# EAGLE board ActuatorBoard (EAGLE 9.6.2)
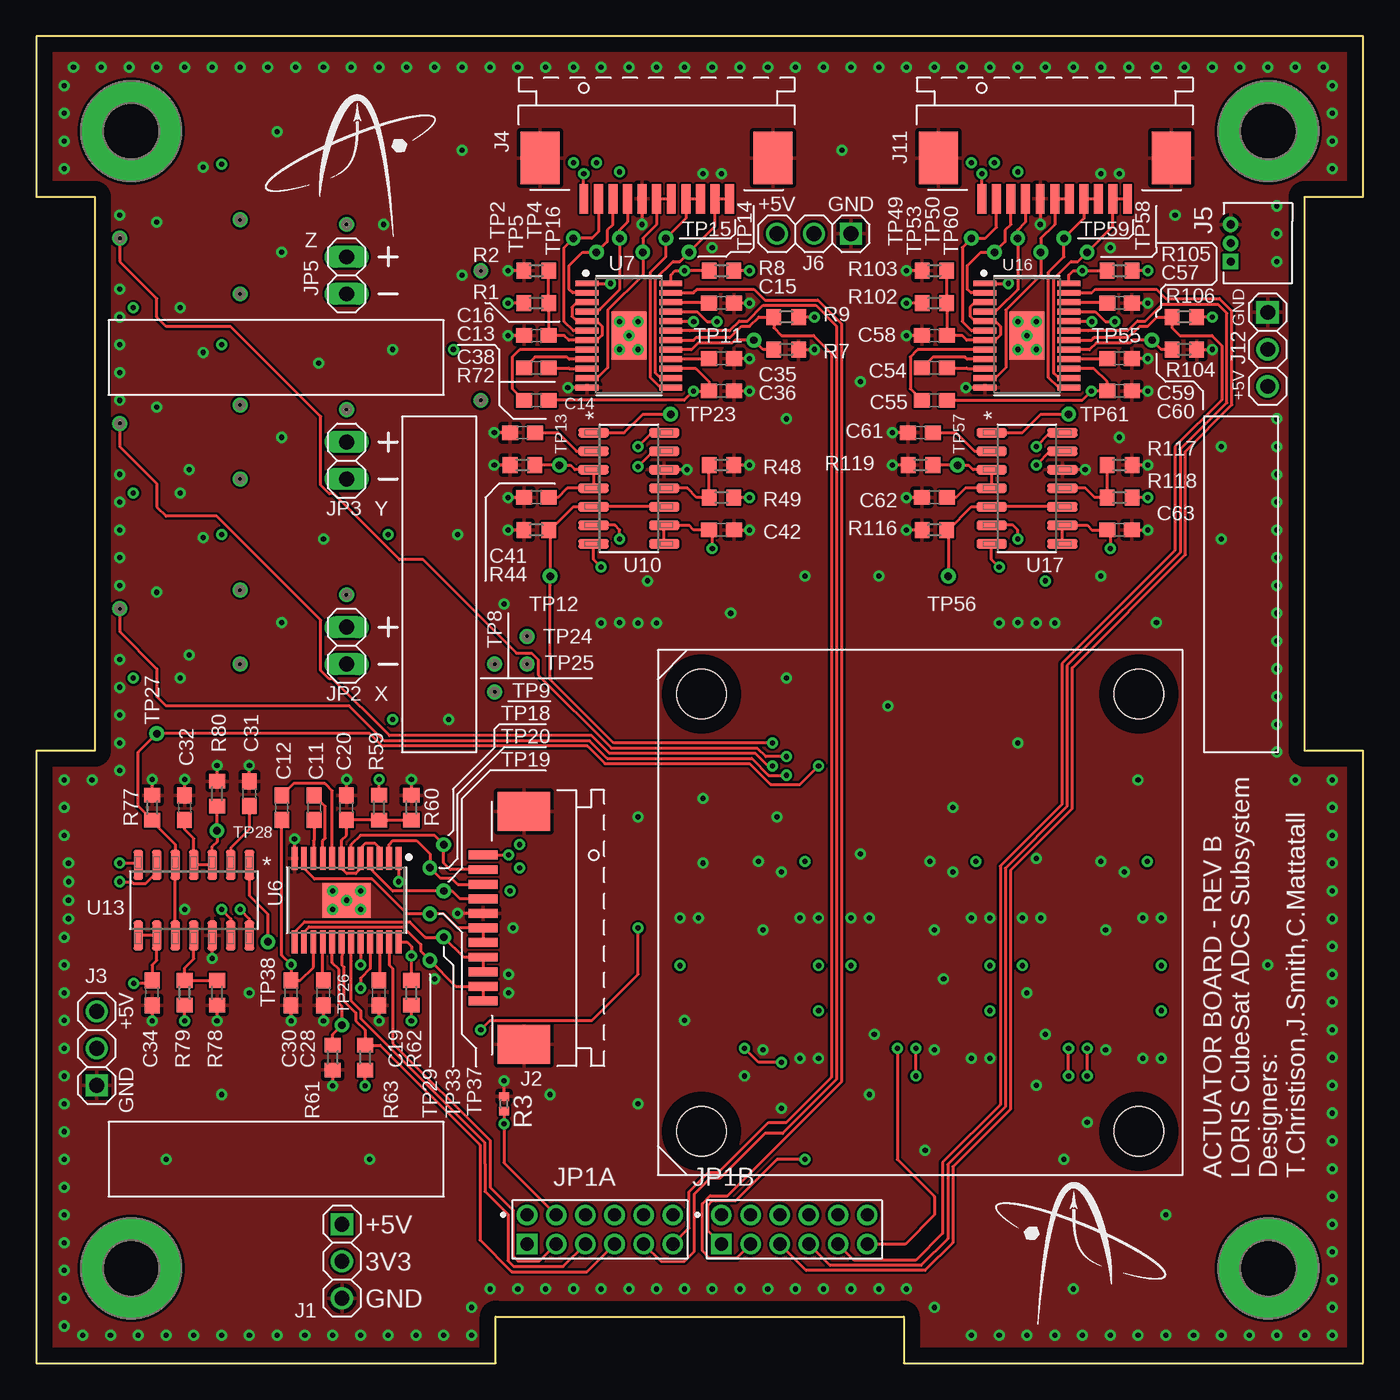
[diagram p6: board, top side]
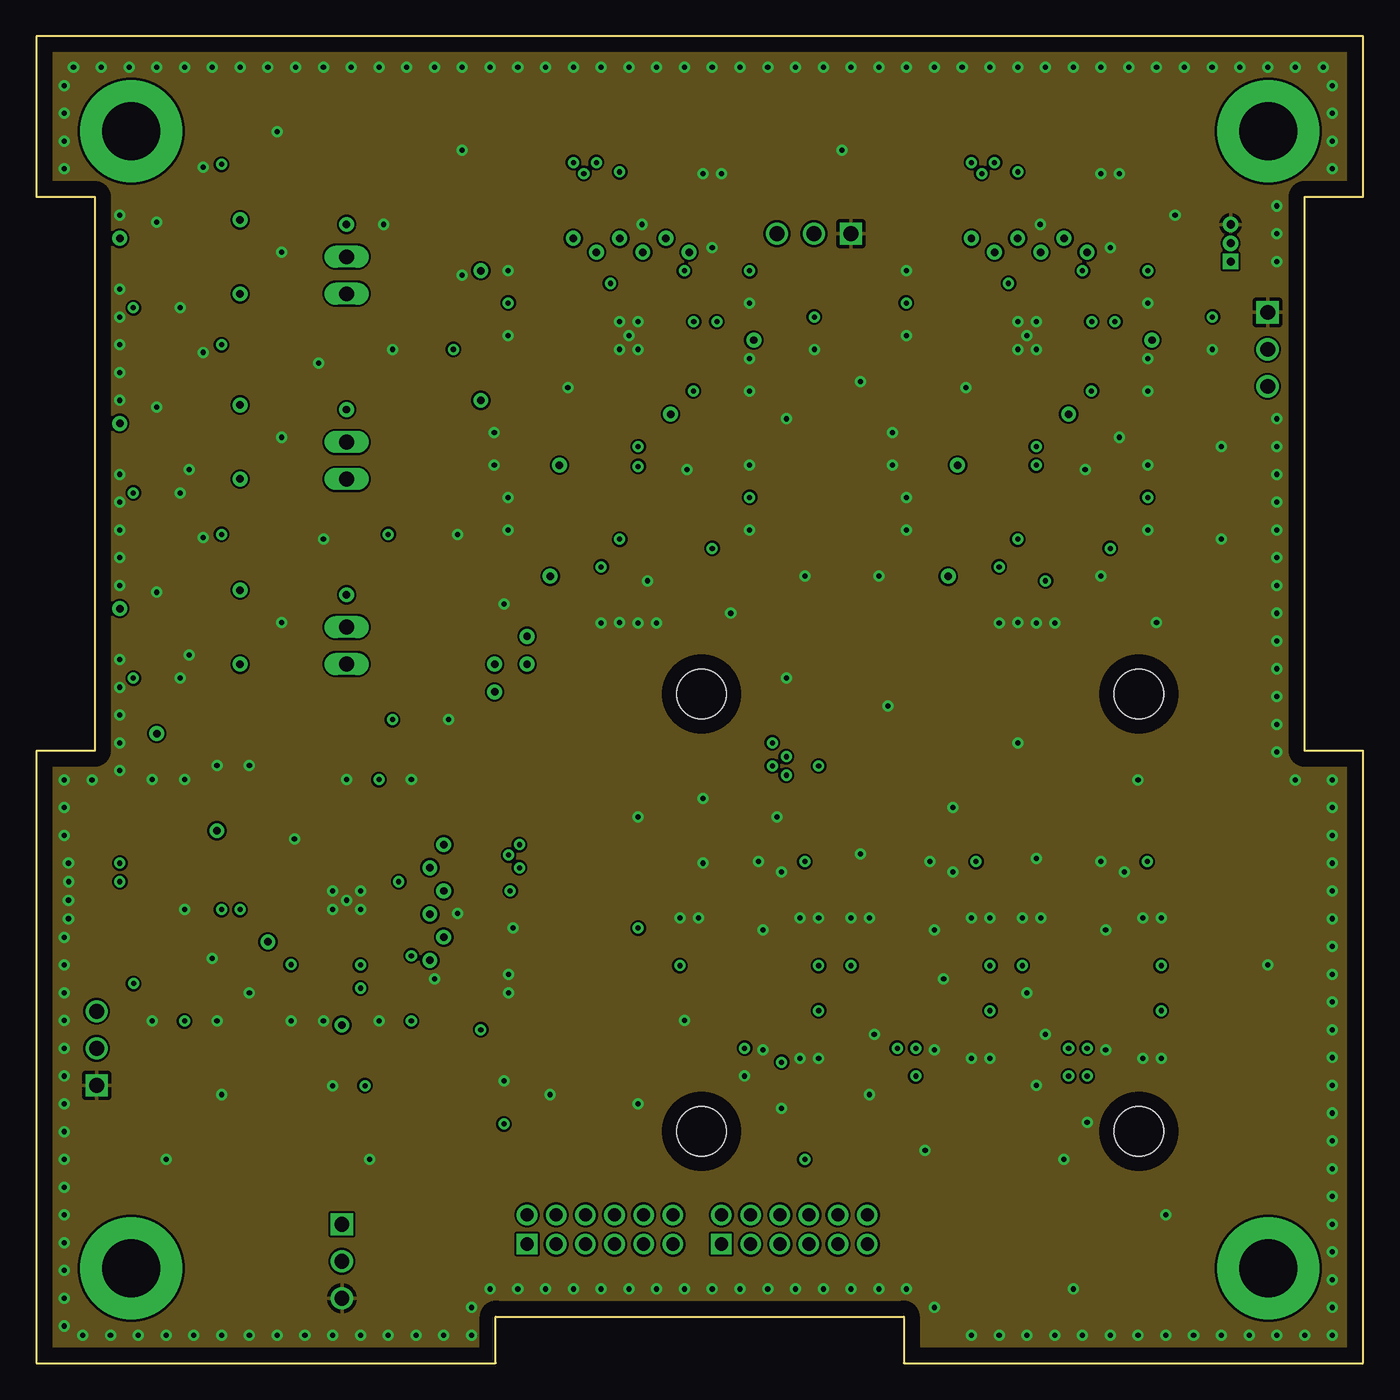
[diagram p7: board, inner layer GND]
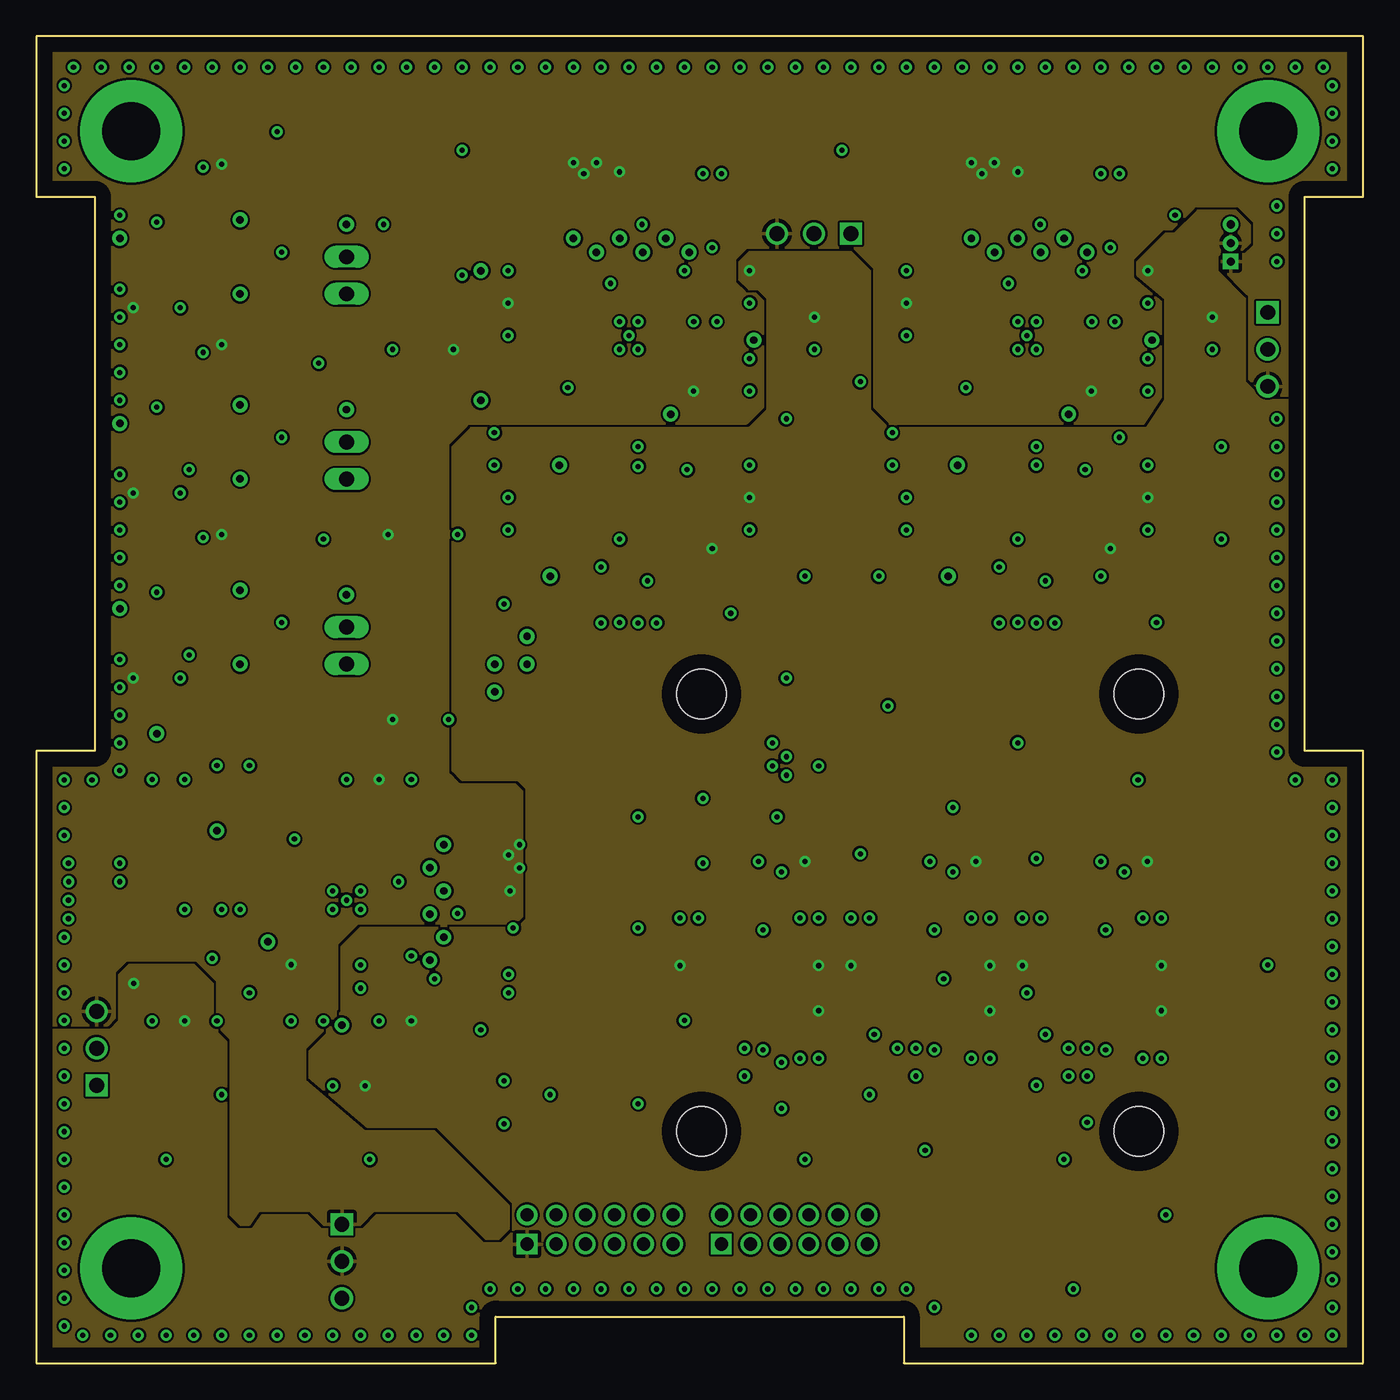
[diagram p8: board, inner layer POWER]
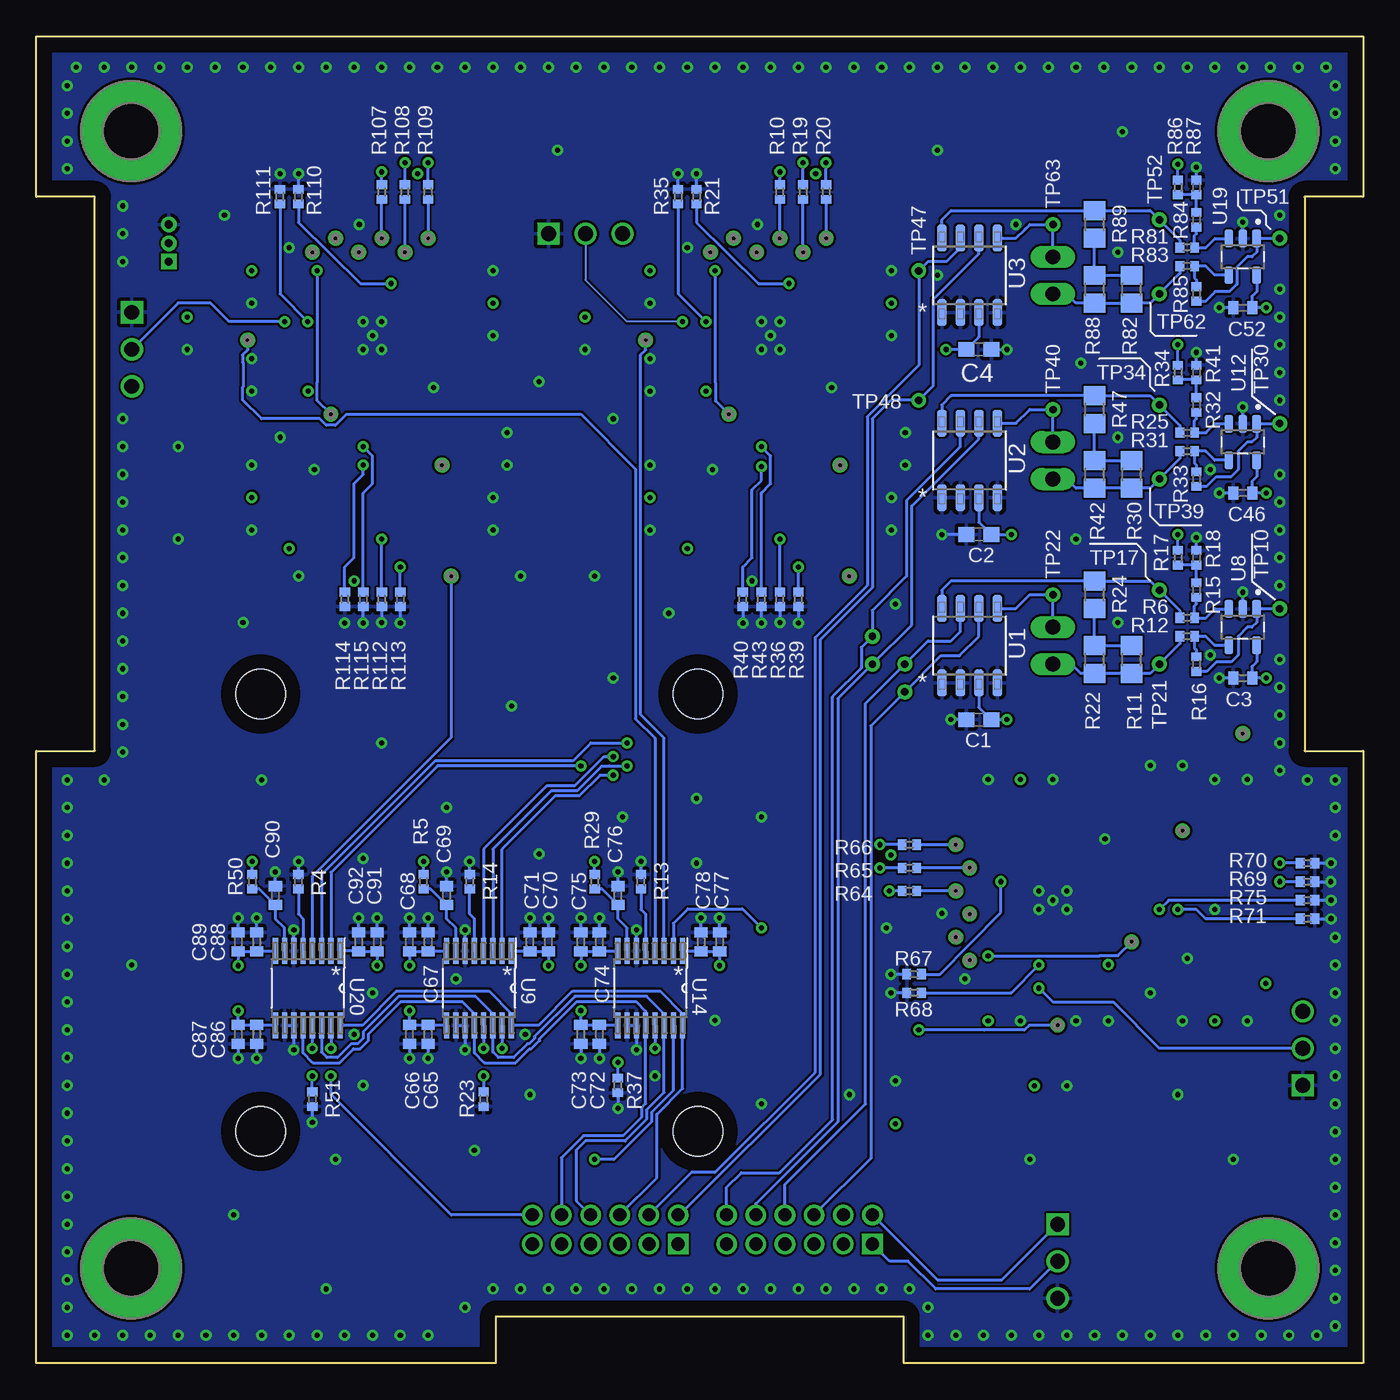
[diagram p9: board, bottom side, seen from below]

Size 91 x 91 mm. Coordinates in mm from the lower left corner, seen from the top.
Outline: 0,42 0,0 31.5,0 31.5,3.19 59.5,3.19 59.5,0 91,0 91,42 87,42 87,80 91,80 91,91 0,91 0,80 4,80 4,42 0,42
Copper layers (1+2*15+16): Top 0.035mm / dielectric 1.5mm / GND 0.035mm / dielectric 0.15mm / POWER 0.035mm / dielectric 0.2mm / Bottom 0.035mm
Design rules "default *": minimum track width 4mil, minimum drill 8mil, track to track 6mil, track to pad 6mil, pad to pad 6mil, via to via 6mil, smd to smd 6mil, copper to edge 40mil, drill to drill 6mil, minimum pad ring 10mil, minimum via ring 8mil, stop-mask expansion 0mil, vias tented up to drill 0mil, thermal gap 10mil

## Footprints (pad centres in the part's own frame; a part is rotated, then mirrored left to right if it is on the bottom)
C0603 = smd 1.1 x 1: 1 -0.85,0; 2 0.85,0
C0402 = smd 0.7 x 0.9: 1 -0.65,0; 2 0.65,0
1X03 = drill 1.016 square: 1 -2.54,0 | drill 1.016: 2 0,0; 3 2.54,0
TE_1-84953-1 = smd 0.61 x 2: 1 5,4.6; 2 4,4.6; 3 3,4.6; 4 2,4.6; 5 1,4.6; 6 0,4.6; 7 -1,4.6; 8 -2,4.6; 9 -3,4.6; 10 -4,4.6; 11 -5,4.6 | smd 2.68 x 3.6: TAB1 7.99,1.8; TAB2 -7.99,1.8
TE-1734829-3 = drill 0.55 square: 1 0,0 | drill 0.55: 2 -1.25,0; 3 -2.54,0
832-10-012-10-005000 = drill 0.9 pad 1.25 square: 1 0,-2 | drill 0.9 pad 1.25: 2 0,0; 3 2,-2; 4 2,0; 5 4,-2; 6 4,0; 7 6,-2; 8 6,0; 9 8,-2; 10 8,0; 11 10,-2; 12 10,0
1X02 = drill 1.016 long: 1 -1.27,0; 2 1.27,0
MTGP700H400 = drill 4 pad 7: 1 0,0
R0603 = smd 1 x 1.1: 1 -0.85,0; 2 0.85,0
R0402 = smd 0.6 x 0.7: 1 -0.5,0; 2 0.5,0
R0805 = smd 1.3 x 1.5: 1 -0.95,0; 2 0.95,0
RWA_NOPINS = hole 3.4: 3,3; 33,33; 33,3; 3,33
TP_P76H50 = drill 0.51 pad 0.762: 1 0,0
SOIC8P127_490X600X175L71X43N_SIP2100DY-T1-GE3 = smd 0.67 x 1.81: 1 -1.905,-2.555; 2 -0.635,-2.555; 3 0.635,-2.555; 4 1.905,-2.555; 5 1.905,2.555; 6 0.635,2.555; 7 -0.635,2.555; 8 -1.905,2.555
SOP65P640X120-25T240X328N = smd 1.572 x 0.407: 1 -2.872,3.575; 2 -2.872,2.925; 3 -2.872,2.275; 4 -2.872,1.625; 5 -2.872,0.975; 6 -2.872,0.325; 7 -2.872,-0.325; 8 -2.872,-0.975; 9 -2.872,-1.625; 10 -2.872,-2.275; 11 -2.872,-2.925; 12 -2.872,-3.575; 13 2.872,-3.575; 14 2.872,-2.925; 15 2.872,-2.275; 16 2.872,-1.625; 17 2.872,-0.975; 18 2.872,-0.325; 19 2.872,0.325; 20 2.872,0.975; 21 2.872,1.625; 22 2.872,2.275; 23 2.872,2.925; 24 2.872,3.575 | smd 2.4 x 3.28: 25 0,0
SOT95P280X145-5N = smd 1.21 x 0.59: 1 -1.255,0.95; 2 -1.255,0; 3 -1.255,-0.95; 4 1.255,-0.95; 5 1.255,0.95
DBQ16 = smd 1.803 x 0.356: 1 -2.553,2.223; 2 -2.553,1.587; 3 -2.553,0.953; 4 -2.553,0.318; 5 -2.553,-0.318; 6 -2.553,-0.953; 7 -2.553,-1.587; 8 -2.553,-2.223; 9 2.553,-2.223; 10 2.553,-1.587; 11 2.553,-0.953; 12 2.553,-0.318; 13 2.553,0.318; 14 2.553,0.953; 15 2.553,1.587; 16 2.553,2.223
SOIC14P127_865X600X175L83X41N_LM2917MX-NOPB = smd 0.66 x 2.07: 1 -3.81,-2.425; 2 -2.54,-2.425; 3 -1.27,-2.425; 4 0,-2.425; 5 1.27,-2.425; 6 2.54,-2.425; 7 3.81,-2.425; 8 3.81,2.425; 9 2.54,2.425; 10 1.27,2.425; 11 0,2.425; 12 -1.27,2.425; 13 -2.54,2.425; 14 -3.81,2.425

## Placement (x,y rotation side)
C1  0.1u  [C0603]  26.35,44.13 180 bottom
C2  0.1u  [C0603]  26.35,56.83 0 bottom
C3  0.1u  [C0402]  8.26,46.99 180 bottom
C4  0.1u  [C0603]  26.35,69.53 180 bottom
C11  0.1u  [C0603]  19.05,38.1 270 top
C12  1u  [C0603]  16.83,38.1 90 top
C13  0.1u  [C0603]  34.29,68.26 0 top
C14  1u  [C0603]  34.29,66.04 180 top
C15  0.033u  [C0603]  46.99,72.71 0 top
C16  0.1u  [C0603]  34.29,70.48 180 top
C19  0.033u  [C0603]  23.5,25.4 270 top
C20  0.1u  [C0603]  21.27,38.1 90 top
C28  2.2u  [C0603]  19.68,25.4 270 top
C30  10u  [C0603]  17.46,25.4 270 top
C31  0.056u  [C0603]  14.61,39.05 270 top
C32  1u  [C0603]  10.16,38.1 270 top
C34  0.1u  [C0603]  7.94,25.4 90 top
C35  2.2u  [C0603]  46.99,68.9 0 top
C36  10u  [C0603]  46.99,66.67 0 top
C38  0.056u  [C0603]  33.34,63.82 0 top
C41  1u  [C0603]  34.29,59.37 0 top
C42  0.1u  [C0603]  46.99,57.15 180 top
C46  0.1u  [C0402]  8.26,59.69 180 bottom
C52  0.1u  [C0402]  8.26,72.39 180 bottom
C54  0.1u  [C0603]  61.59,68.26 0 top
C55  1u  [C0603]  61.59,66.04 180 top
C57  0.033u  [C0603]  74.3,72.71 0 top
C58  0.1u  [C0603]  61.59,70.48 180 top
C59  2.2u  [C0603]  74.3,68.9 0 top
C60  10u  [C0603]  74.3,66.67 0 top
C61  0.056u  [C0603]  60.64,63.82 0 top
C62  1u  [C0603]  61.59,59.37 0 top
C63  0.1u  [C0603]  74.3,57.15 180 top
C65  0.1u  [C0402]  64.14,22.54 270 bottom
C66  1u  [C0402]  65.41,22.54 270 bottom
C67  0.1u  [C0402]  64.14,28.89 90 bottom
C68  1u  [C0402]  65.41,28.89 90 bottom
C69  0.1u  [C0402]  62.87,32.07 90 bottom
C70  1u  [C0402]  55.88,28.89 90 bottom
C71  0.1u  [C0402]  57.15,28.89 90 bottom
C72  0.1u  [C0402]  52.39,22.54 270 bottom
C73  1u  [C0402]  53.66,22.54 270 bottom
C74  0.1u  [C0402]  52.39,28.89 90 bottom
C75  1u  [C0402]  53.66,28.89 90 bottom
C76  0.1u  [C0402]  51.12,32.07 90 bottom
C77  1u  [C0402]  44.13,28.89 90 bottom
C78  0.1u  [C0402]  45.4,28.89 90 bottom
C86  0.1u  [C0402]  75.88,22.54 270 bottom
C87  1u  [C0402]  77.15,22.54 270 bottom
C88  0.1u  [C0402]  75.88,28.89 90 bottom
C89  1u  [C0402]  77.15,28.89 90 bottom
C90  0.1u  [C0402]  74.61,32.07 90 bottom
C91  1u  [C0402]  67.63,28.89 90 bottom
C92  0.1u  [C0402]  68.9,28.89 90 bottom
J1  [1X03]  20.95,6.99 270 top
J2  TE_1-84953-1  [TE_1-84953-1]  35.24,29.84 90 top
J3  [1X03]  4.13,21.59 90 top
J4  TE_1-84953-1  [TE_1-84953-1]  42.55,84.45 180 top
J5  TE-1734829-3  [TE-1734829-3]  81.92,75.56 270 top
J6  [1X03]  53.34,77.47 180 top
J11  TE_1-84953-1  [TE_1-84953-1]  69.85,84.45 180 top
J12  [1X03]  84.45,69.53 270 top
JP1A  832-10-012-10-005000  [832-10-012-10-005000]  33.66,10.16 0 top
JP1B  832-10-012-10-005000  [832-10-012-10-005000]  46.99,10.16 0 top
JP2  [1X02]  21.27,49.21 90 top
JP3  [1X02]  21.27,61.91 90 top
JP5  [1X02]  21.27,74.61 90 top
MH5  MTGP700H400  [MTGP700H400]  6.5,6.5 0 top
MH6  MTGP700H400  [MTGP700H400]  84.5,6.5 0 top
MH7  MTGP700H400  [MTGP700H400]  84.5,84.5 0 top
MH8  MTGP700H400  [MTGP700H400]  6.5,84.5 0 top
MX  NCTR-M002_MAGNETORQUER  [MAG_MOUNT_V3]  25.08,41.91 0 top
MY  NCTR-M002_MAGNETORQUER  [MAG_MOUNT_V3]  27.94,11.43 90 top
R1  10K  [R0603]  34.29,72.71 180 top
R2  10K  [R0603]  34.29,74.93 0 top
R3  5.1M  [R0402]  32.07,17.78 270 top
R4  5.1M  [R0402]  73.03,33.02 90 bottom
R5  10K  [R0402]  64.45,33.02 90 bottom
R6  5.1k  [R0402]  12.06,51.12 180 bottom
R7  27K  [R0603]  51.44,69.53 180 top
R8  3.3k  [R0603]  46.99,74.93 180 top
R9  3.3k  [R0603]  51.44,71.75 180 top
R10  4.7k  [R0402]  40.01,80.33 90 bottom
R11  100R  [R0805]  15.88,48.26 90 bottom
R12  5.1k  [R0402]  12.06,49.85 180 bottom
R13  5.1M  [R0402]  49.53,33.02 90 bottom
R14  5.1M  [R0402]  61.28,33.02 90 bottom
R15  1.8k  [R0402]  11.43,53.02 270 bottom
R16  1.8k  [R0402]  11.43,47.94 270 bottom
R17  2.2k  [R0402]  12.7,55.24 90 bottom
R18  1.1k  [R0402]  11.43,55.24 270 bottom
R19  4.7k  [R0402]  38.42,80.33 90 bottom
R20  4.7k  [R0402]  36.83,80.33 90 bottom
R21  5.1M  [R0402]  45.72,80.01 270 bottom
R22  470R  [R0805]  18.41,48.26 90 bottom
R23  5.1M  [R0402]  60.33,18.1 90 bottom
R24  0R  [R0805]  18.41,52.7 90 bottom
R25  5.1k  [R0402]  12.06,63.82 180 bottom
R29  10K  [R0402]  52.7,33.02 90 bottom
R30  100R  [R0805]  15.88,60.96 90 bottom
R31  5.1k  [R0402]  12.06,62.55 180 bottom
R32  1.8k  [R0402]  11.43,65.72 270 bottom
R33  1.8k  [R0402]  11.43,60.64 270 bottom
R34  2.2k  [R0402]  12.7,67.94 90 bottom
R35  5.1M  [R0402]  46.99,80.01 90 bottom
R36  5.1M  [R0402]  40.01,52.39 270 bottom
R37  5.1M  [R0402]  51.12,19.05 90 bottom
R39  5.1M  [R0402]  38.73,52.39 270 bottom
R40  5.1M  [R0402]  42.55,52.39 270 bottom
R41  1.1k  [R0402]  11.43,67.94 270 bottom
R42  470R  [R0805]  18.41,60.96 90 bottom
R43  5.1M  [R0402]  41.27,52.39 270 bottom
R44  10k  [R0603]  34.29,57.15 0 top
R47  0R  [R0805]  18.41,65.41 90 bottom
R48  2k  [R0603]  46.99,61.59 0 top
R49  1k  [R0603]  46.99,59.37 180 top
R50  10K  [R0402]  76.2,33.02 90 bottom
R51  5.1M  [R0402]  72.07,18.1 90 bottom
R59  10K  [R0603]  23.5,38.1 90 top
R60  10K  [R0603]  25.72,38.1 270 top
R61  27K  [R0603]  20.32,20.95 90 top
R62  3.3k  [R0603]  25.72,25.4 90 top
R63  3.3k  [R0603]  22.54,20.95 90 top
R64  4.7k  [R0402]  31.11,32.38 180 bottom
R65  4.7k  [R0402]  31.11,33.97 180 bottom
R66  4.7k  [R0402]  31.11,35.56 180 bottom
R67  5.1M  [R0402]  30.8,26.67 0 bottom
R68  5.1M  [R0402]  30.8,25.4 180 bottom
R69  5.1M  [R0402]  3.81,33.02 0 bottom
R70  5.1M  [R0402]  3.81,34.29 0 bottom
R71  5.1M  [R0402]  3.81,30.48 0 bottom
R72  100k  [R0603]  33.34,61.59 0 top
R75  5.1M  [R0402]  3.81,31.75 0 bottom
R77  10k  [R0603]  7.94,38.1 270 top
R78  2k  [R0603]  12.38,25.4 270 top
R79  1k  [R0603]  10.16,25.4 90 top
R80  100k  [R0603]  12.38,39.05 270 top
R81  5.1k  [R0402]  12.06,76.52 180 bottom
R82  100R  [R0805]  15.88,73.66 90 bottom
R83  5.1k  [R0402]  12.06,75.25 180 bottom
R84  1.8k  [R0402]  11.43,78.42 270 bottom
R85  1.8k  [R0402]  11.43,73.34 270 bottom
R86  2.2k  [R0402]  12.7,80.64 90 bottom
R87  1.1k  [R0402]  11.43,80.64 270 bottom
R88  470R  [R0805]  18.41,73.66 90 bottom
R89  0R  [R0805]  18.41,78.11 90 bottom
R102  10K  [R0603]  61.59,72.71 180 top
R103  10K  [R0603]  61.59,74.93 0 top
R104  27K  [R0603]  78.74,69.53 180 top
R105  3.3k  [R0603]  74.3,74.93 180 top
R106  3.3k  [R0603]  78.74,71.75 180 top
R107  4.7k  [R0402]  67.31,80.33 90 bottom
R108  4.7k  [R0402]  65.72,80.33 90 bottom
R109  4.7k  [R0402]  64.14,80.33 90 bottom
R110  5.1M  [R0402]  73.03,80.01 270 bottom
R111  5.1M  [R0402]  74.3,80.01 90 bottom
R112  5.1M  [R0402]  67.31,52.39 270 bottom
R113  5.1M  [R0402]  66.04,52.39 270 bottom
R114  5.1M  [R0402]  69.85,52.39 270 bottom
R115  5.1M  [R0402]  68.58,52.39 270 bottom
R116  10k  [R0603]  61.59,57.15 0 top
R117  2k  [R0603]  74.3,61.59 0 top
R118  1k  [R0603]  74.3,59.37 180 top
R119  100k  [R0603]  60.64,61.59 0 top
RWZ  REACTION_WHEEL_NOPINS_MAXON  [RWA_NOPINS]  42.62,48.9 270 top
TP2  TESTPOINT  [TP_P76H50]  36.83,77.15 270 top
TP4  TESTPOINT  [TP_P76H50]  40.01,77.15 270 top
TP5  TESTPOINT  [TP_P76H50]  38.42,76.2 270 top
TP8  TESTPOINT  [TP_P76H50]  31.43,47.94 90 bottom
TP9  TESTPOINT  [TP_P76H50]  31.43,46.04 90 bottom
TP10  TESTPOINT  [TP_P76H50]  5.71,51.75 90 bottom
TP11  TESTPOINT  [TP_P76H50]  49.21,70.17 0 top
TP12  TESTPOINT  [TP_P76H50]  35.24,53.98 270 top
TP13  TESTPOINT  [TP_P76H50]  35.88,61.59 270 top
TP14  TESTPOINT  [TP_P76H50]  44.77,76.2 270 top
TP15  TESTPOINT  [TP_P76H50]  43.18,77.15 270 top
TP16  TESTPOINT  [TP_P76H50]  41.59,76.2 270 top
TP17  TESTPOINT  [TP_P76H50]  13.97,53.02 180 bottom
TP18  TESTPOINT  [TP_P76H50]  27.94,35.56 180 top
TP19  TESTPOINT  [TP_P76H50]  27.94,32.38 180 top
TP20  TESTPOINT  [TP_P76H50]  26.99,33.97 180 top
TP21  TESTPOINT  [TP_P76H50]  13.97,47.94 180 bottom
TP22  TESTPOINT  [TP_P76H50]  21.27,52.7 180 bottom
TP23  TESTPOINT  [TP_P76H50]  43.5,65.09 270 top
TP24  TESTPOINT  [TP_P76H50]  33.66,49.85 90 bottom
TP25  TESTPOINT  [TP_P76H50]  33.66,47.94 90 bottom
TP26  TESTPOINT  [TP_P76H50]  20.95,23.18 270 top
TP27  TESTPOINT  [TP_P76H50]  8.26,43.18 180 top
TP28  TESTPOINT  [TP_P76H50]  12.38,36.51 180 top
TP29  TESTPOINT  [TP_P76H50]  26.99,27.62 180 top
TP30  TESTPOINT  [TP_P76H50]  5.71,64.45 90 bottom
TP33  TESTPOINT  [TP_P76H50]  27.94,29.21 180 top
TP34  TESTPOINT  [TP_P76H50]  13.97,65.72 180 bottom
TP37  TESTPOINT  [TP_P76H50]  26.99,30.8 180 top
TP38  TESTPOINT  [TP_P76H50]  15.88,28.89 180 top
TP39  TESTPOINT  [TP_P76H50]  13.97,60.64 180 bottom
TP40  TESTPOINT  [TP_P76H50]  21.27,65.41 180 bottom
TP47  TESTPOINT  [TP_P76H50]  30.48,74.93 90 bottom
TP48  TESTPOINT  [TP_P76H50]  30.48,66.04 90 bottom
TP49  TESTPOINT  [TP_P76H50]  64.14,77.15 270 top
TP50  TESTPOINT  [TP_P76H50]  67.31,77.15 270 top
TP51  TESTPOINT  [TP_P76H50]  5.71,77.15 90 bottom
TP52  TESTPOINT  [TP_P76H50]  13.97,78.42 180 bottom
TP53  TESTPOINT  [TP_P76H50]  65.72,76.2 270 top
TP55  TESTPOINT  [TP_P76H50]  76.52,70.17 0 top
TP56  TESTPOINT  [TP_P76H50]  62.55,53.98 270 top
TP57  TESTPOINT  [TP_P76H50]  63.18,61.59 270 top
TP58  TESTPOINT  [TP_P76H50]  72.07,76.2 270 top
TP59  TESTPOINT  [TP_P76H50]  70.48,77.15 270 top
TP60  TESTPOINT  [TP_P76H50]  68.9,76.2 270 top
TP61  TESTPOINT  [TP_P76H50]  70.8,65.09 270 top
TP62  TESTPOINT  [TP_P76H50]  13.97,73.34 180 bottom
TP63  TESTPOINT  [TP_P76H50]  21.27,78.11 180 bottom
U1  SIP2100DY-T1-GE3  [SOIC8P127_490X600X175L71X43N_SIP2100DY-T1-GE3]  26.99,49.21 0 bottom
U2  SIP2100DY-T1-GE3  [SOIC8P127_490X600X175L71X43N_SIP2100DY-T1-GE3]  26.99,61.91 0 bottom
U3  SIP2100DY-T1-GE3  [SOIC8P127_490X600X175L71X43N_SIP2100DY-T1-GE3]  26.99,74.61 0 bottom
U6  DRV10970_MOTOR_DRIVERDRV10970  [SOP65P640X120-25T240X328N]  21.27,31.75 270 top
U7  DRV10970_MOTOR_DRIVERDRV10970  [SOP65P640X120-25T240X328N]  40.64,70.48 0 top
U8  TSV991AILT  [SOT95P280X145-5N]  8.26,50.48 270 bottom
U9  ADS7841E_2K5  [DBQ16]  60.64,25.72 270 bottom
U10  LM2917MX/NOPB  [SOIC14P127_865X600X175L83X41N_LM2917MX-NOPB]  40.64,60.01 270 top
U12  TSV991AILT  [SOT95P280X145-5N]  8.26,63.18 270 bottom
U13  LM2917MX/NOPB  [SOIC14P127_865X600X175L83X41N_LM2917MX-NOPB]  10.79,31.75 180 top
U14  ADS7841E_2K5  [DBQ16]  48.9,25.72 270 bottom
U16  DRV10970_MOTOR_DRIVERDRV10970  [SOP65P640X120-25T240X328N]  67.94,70.48 0 top
U17  LM2917MX/NOPB  [SOIC14P127_865X600X175L83X41N_LM2917MX-NOPB]  67.94,60.01 270 top
U19  TSV991AILT  [SOT95P280X145-5N]  8.26,75.88 270 bottom
U20  ADS7841E_2K5  [DBQ16]  72.39,25.72 270 bottom

## Tracks (layer width: path | path; a pad name or v marks a point on that pad's centre or on a via)
!CS!_CURR_SENSE_MTQR  (via drill 0.35)
  Top 0.203: v59.05,21.59 59.05,13.97 61.59,11.43 61.59,10.16 59.59,8.16 JP1B.11
  Bottom 0.203: U9.15 v59.05,21.59
!CS!_CURR_SENSE_RW  (via drill 0.35)
  Top 0.203: v52.7,13.97 50.8,13.97 47.95,11.12 46.59,11.12 46.59,11.11 46.35,11.11 46.03,10.79 46.03,9.12 JP1B.1
  Bottom 0.203: U14.15 47.31,18.7 48.8,17.21 48.8,16.55 51.38,13.97 v52.7,13.97
!CS!_SPD_SENSE_RW  (via drill 0.35)
  Top 0.203: v70.8,19.68 v70.8,21.59
  Bottom 0.203: U20.15 v70.8,21.59 | v70.8,19.68 70.8,18.41 62.55,10.16 JP1B.12
+3V3  (via drill 0.35)
  Top 0.152: U10.9 43.18,57.47 | U17.9 70.48,57.47
  Top 0.203: v25.72,23.47 R62.1 | v22.54,19.02 R63.1 | v10.16,23.47 R79.1 | v48.92,74.93 R8.1 | v53.37,71.75 R9.1 | v48.92,59.37 R49.1 | U10.8 43.06,57.35 43.18,57.47 | v76.23,74.93 R105.1 | v80.67,71.75 R106.1 | v76.23,59.37 R118.1 | U17.8 70.37,57.35 70.48,57.47 | v46.35,55.88 46.35,56.83 46.14,57.05 C42.2 45.09,57.15 44.77,57.47 U10.9 | v73.66,55.88 73.66,56.94 C63.2 72.39,57.15 72.07,57.47 U17.9 | v6.67,26.04 7.72,26.04 C34.2 7.94,27.3 8.26,27.62 8.26,29.21 8.14,29.32 | 8.14,29.32 U13.8 | U13.9 8.14,29.32
  Bottom 0.203: U9.8 64.11,28.27 C67.1 C68.1 v65.41,27.26 | U9.9 62.89,23.19 C65.1 C66.1 v65.41,24.17 | U9.1 57.18,28.27 C71.1 C70.1 v55.88,27.26 | R5.2 v64.45,34.4 | U14.8 52.36,28.27 C74.1 C75.1 v53.66,27.26 | U14.1 45.43,28.27 C78.1 C77.1 v44.13,27.26 | R29.2 v52.7,34.4 | U20.8 75.86,28.27 C88.1 C89.1 v77.15,27.26 | U20.1 68.92,28.27 C92.1 C91.1 v67.63,27.26 | R50.2 v76.2,34.4 | U20.9 74.64,23.19 C86.1 C87.1 v77.15,24.17 | U14.9 51.15,23.19 C72.1 C73.1 v53.66,24.17 | J1.2 22.86,5.08 29.3,5.08 31.21,6.99 32.48,6.99 JP1A.1
  pour POWER (rank 2): -1.27,-1.91 -1.27,21.59 0,22.86 5.08,22.86 5.71,23.5 5.71,26.67 6.35,27.3 10.79,27.3 12.05,26.05 12.05,23.51 12.7,22.86 19.68,22.86 20.95,24.13 20.95,28.57 22.23,29.84 33.02,29.84 33.66,30.48 33.66,39.37 33.02,40.01 29.21,40.01 28.57,40.64 28.57,62.87 29.84,64.14 48.9,64.14 50.16,65.41 50.16,73.03 49.53,73.66 48.9,73.66 48.26,74.3 48.26,75.56 48.9,76.2 55.88,76.2 57.15,74.93 57.15,65.41 58.42,64.14 76.2,64.14 77.47,66.04 77.47,73.03 75.56,74.61 75.56,75.56 77.47,77.47 78.11,77.47 79.69,79.06 82.23,79.06 83.19,78.11 83.19,76.83 82.55,76.2 81.28,76.2 80.96,75.88 80.96,74.93 82.87,73.03 82.87,67.31 84.14,66.04 86.36,66.04 86.36,64.14 94.61,64.14 94.61,-1.91
+5V  (via drill 0.35)
  Top 0.203: R59.2 v23.5,40.03 | J2.1 v32.38,34.84 | U6.15 19,27.15 18.1,26.25 C30.1 v17.46,27.33 16.83,27.97 C12.1 | R1.2 v32.36,72.71 | C14.1 44.42,66.04 v45.06,66.67 C36.1 46.14,67.31 45.24,68.21 U7.15 | J4.1 v37.55,81.6 | R102.2 v59.66,72.71 | J11.1 v64.85,81.6 | U16.15 72.55,68.21 73.44,67.31 C60.1 v72.36,66.67 71.73,66.04 C55.1
  Bottom 0.203: R66.2 v33.13,35.56 | R65.2 v33.13,33.97 | R64.2 v32.5,32.38 | R20.2 v36.83,82.34 | R19.2 v38.42,82.34 | R10.2 v40.01,81.71 | R109.2 v64.14,82.34 | R108.2 v65.72,82.34 | R107.2 v67.31,81.71 | v6.64,46.99 C3.1 7.61,47.79 7.3,48.09 U8.5 | v6.64,59.69 C46.1 7.61,60.49 7.3,60.79 U12.5 | v6.64,72.39 C52.1 7.61,73.19 7.3,73.49 U19.5 | R34.2 v12.7,69.85 | R86.2 v12.7,82.23 | v24.42,44.13 C1.1 26.35,44.98 U1.3 | R17.2 v12.7,56.83 | v24.13,56.83 C2.2 26.35,57.68 U2.3 | v28.6,69.53 C4.2 26.35,70.38 U3.3 | J1.1 24.77,5.71 29.21,5.71 JP1A.2
  pour POWER (rank 3): -3.17,92.71 92.71,92.71 92.71,64.14 29.84,64.14 28.57,62.87 28.57,40.64 29.21,40.01 33.02,40.01 33.66,39.37 33.66,30.48 33.02,29.84 22.23,29.84 20.95,28.57 20.95,24.13 19.68,22.86 -3.17,22.86
  pour POWER: 13.34,10.16 13.97,9.53 14.61,9.53 15.24,10.48 18.73,10.48 19.68,9.53 22.23,9.53 23.18,10.48 28.89,10.48 30.8,8.57 31.75,8.57 32.38,9.21 32.38,10.79 27.3,15.88 22.54,15.88 18.41,19.37 18.41,21.59 19.68,22.86 19.05,23.5 12.7,23.5 12.7,22.86 13.34,22.23
BRKMOD_X  (via drill 0.35)
  Top 0.203: U7.21 45.33,72.11 46,71.44 v46.67,71.44
  Bottom 0.152: J6.2 53.34,74.3 50.48,71.44 v46.67,71.44
BRKMOD_Y  (via drill 0.35)
  Top 0.203: U16.21 72.63,72.11 73.31,71.44 v73.98,71.44
  Bottom 0.203: J12.2 81.28,72.71 79.06,72.71 77.79,71.44 v73.98,71.44
BRKMOD_Z  (via drill 0.35)
  Top 0.203: U6.21 22.9,27.06 22.23,26.39 v22.23,25.72
  Bottom 0.203: J3.2 13.97,21.59 17.14,24.77 21.27,24.77 v22.23,25.72
CUR_OUT1  (via drill 0.35)
  Top 0.203: TP10.1 5.71,50.16 8.26,47.62 8.26,45.72 8.89,45.09 21.46,45.09 23.86,42.68 37.94,42.68 39.15,41.48 49.07,41.48 50.22,40.32 v51.44,40.32
  Bottom 0.203: TP10.1 7.29,51.75 U8.1 7.3,50.8 7.62,50.48 7.94,50.48 8.57,49.85 8.57,48.58 9.05,48.1 10.06,48.1 10.72,47.44 R16.2 | U9.2 59.05,35.26 55.41,38.9 53.77,38.9 52.35,40.32 v51.44,40.32
CUR_OUT2  (via drill 0.35)
  Top 0.203: TP30.1 5.71,62.87 8.26,60.33 8.26,58.72 8.89,58.09 12.37,58.09 19.49,50.96 19.49,47.52 20.09,46.93 20.32,46.93 24.21,43.04 38.09,43.04 39.29,41.83 49.29,41.83 50.16,40.96 v50.48,40.96
  Bottom 0.203: TP30.1 7.29,64.45 U12.1 7.3,63.5 7.62,63.18 7.94,63.18 8.57,62.55 8.57,61.28 9.05,60.8 10.06,60.8 10.72,60.14 R33.2 | U9.3 59.69,35.26 55.69,39.26 53.92,39.26 52.24,40.93 51.72,40.93 51.69,40.96 v50.48,40.96
CUR_OUT3  (via drill 0.35)
  Top 0.203: TP51.1 5.71,75.56 8.26,73.03 8.26,71.75 8.91,71.1 13.32,71.1 19.49,64.93 19.49,60.22 20.09,59.63 20.38,59.63 24.91,55.1 26.53,55.1 32.92,48.71 33.97,48.71 34.42,48.26 34.42,47.21 39.44,42.19 49.44,42.19 50.03,41.59 v51.44,41.59
  Bottom 0.203: TP51.1 7.29,77.15 U19.1 7.3,76.2 7.62,75.88 7.94,75.88 8.66,75.16 8.66,74 9.16,73.5 10.14,73.5 10.79,72.84 R85.2 | v51.44,41.59 51.45,41.6 52.07,41.6 54.06,39.61 55.97,39.61 60.33,35.26 U9.4
GND  (via drill 0.35)
  Top 0.203: C20.2 v21.27,40.03 | R60.1 v25.72,40.03 | v23.5,23.47 C19.2 | R61.1 v20.32,19.02 | U6.12 v17.7,35.94 | v19.68,23.47 C28.2 | v17.46,23.47 C30.2 | v12.06,27.76 U13.12 | R80.1 v12.38,40.98 | C31.1 v14.61,40.98 | C32.1 v10.16,40.03 | v12.38,23.47 R78.2 | C34.1 v7.94,23.47 | R77.1 v7.94,40.03 | J2.5 v28.89,30.84 | C16.2 v32.36,70.48 | R2.1 v32.36,74.93 | v48.92,72.71 C15.2 | R7.1 v53.37,69.53 | U7.12 v36.45,66.91 | v48.92,68.9 C35.2 | v48.92,66.67 C36.2 | v44.63,61.28 U10.12 | R72.1 v31.41,61.59 | C38.1 v31.41,63.82 | C41.1 v32.36,59.37 | v48.92,61.59 R48.2 | C42.1 v48.92,57.15 | R44.1 v32.36,57.15 | J4.5 v41.55,78.11 | C58.2 v59.66,70.48 | R103.1 v59.66,74.93 | v76.23,72.71 C57.2 | R104.1 v80.67,69.53 | U16.12 v63.76,66.91 | v76.23,68.9 C59.2 | v76.23,66.67 C60.2 | v71.94,61.28 U17.12 | R119.1 v58.71,61.59 | C61.1 v58.71,63.82 | C62.1 v59.66,59.37 | v76.23,61.59 R117.2 | C63.1 v76.23,57.15 | R116.1 v59.66,57.15 | J11.5 v68.85,78.11 | R3.1 v32.07,19.37
  Bottom 0.203: R68.2 v32.38,25.4 | R67.1 v32.38,26.67 | R70.2 v2.2,34.29 | R71.2 v2.2,30.48 | v2.2,31.75 R75.2 | R69.2 v2.22,33.02 | R35.2 v46.99,81.6 | R21.1 v45.72,81.6 | R39.2 v38.73,50.77 | R40.2 v42.55,50.77 | v41.27,50.77 R43.2 | R36.2 v40.01,50.8 | R110.1 v73.03,81.6 | R113.2 v66.04,50.77 | v68.58,50.77 R115.2 | R112.2 v67.31,50.8 | C1.2 v28.28,44.13 | C3.2 v9.87,46.99 | U8.2 v8.26,52.87 | C46.2 v9.87,59.69 | U12.2 v8.26,65.57 | C52.2 v9.87,72.39 | U19.2 v8.26,78.27 | C71.2 v57.15,30.52 | C70.2 v55.88,30.52 | C68.2 v65.41,30.52 | C66.2 v65.41,20.91 | v61.59,21.5 U9.11 U9.10 | U9.6 v61.59,29.7 | C65.2 v64.14,20.91 | C67.2 v64.14,30.52 | C76.2 v51.12,33.7 | C78.2 v45.4,30.52 | C77.2 v44.13,30.52 | C75.2 v53.66,30.52 | C73.2 v53.66,20.91 | v49.85,21.5 U14.11 U14.10 | U14.6 v49.85,29.7 | C72.2 v52.39,20.91 | C74.2 v52.39,30.52 | R37.1 v51.12,17.46 | C90.2 v74.61,33.7 | C92.2 v68.9,30.52 | C91.2 v67.63,30.52 | C89.2 v77.15,30.52 | C87.2 v77.15,20.91 | v73.34,21.5 U20.11 U20.10 | U20.6 v73.34,29.7 | C86.2 v75.88,20.91 | C88.2 v75.88,30.52 | R51.1 v72.07,16.51 | R41.1 v11.43,69.33 | R18.1 v11.43,56.63 | R87.1 v11.43,82.03 | C69.2 v62.87,33.7 | C2.1 v28.89,56.83 | C4.1 v24.42,69.53 | R4.2 v73.03,34.4 | R13.2 v49.53,34.4 | R14.2 v61.28,34.4
  other vias: 20.32,31.11 22.23,31.11 21.27,31.75 22.23,32.38 20.32,32.38 41.27,69.53 41.27,71.44 40.64,70.48 40.01,71.44 40.01,69.53 68.58,69.53 68.58,71.44 67.94,70.48 67.31,71.44 67.31,69.53 74.3,81.6 69.85,50.77 10.79,1.91 12.7,1.91 14.61,1.91 22.23,1.91 24.13,1.91 26.04,1.91 27.94,1.91 29.84,1.91 29.84,3.81 1.91,10.16 1.91,12.06 1.91,13.97 1.91,15.88 1.91,36.2 1.91,38.1 5.71,40.64 5.71,42.55 5.71,53.34 5.71,55.24 5.71,57.15 5.71,66.04 5.71,67.94 5.71,69.85 5.71,78.74 1.91,85.72 2.54,88.9 4.45,88.9 6.35,88.9 8.26,88.9 10.16,88.9 12.06,88.9 1.91,87.63 13.97,88.9 15.88,88.9 17.78,88.9 19.68,88.9 21.59,88.9 23.5,88.9 25.4,88.9 27.3,88.9 29.21,88.9 31.11,88.9 33.02,88.9 34.92,88.9 36.83,88.9 38.73,88.9 40.64,88.9 42.55,88.9 44.45,88.9 46.35,88.9 48.26,88.9 50.16,88.9 52.07,88.9 53.98,88.9 55.88,88.9 57.78,88.9 59.69,88.9 61.59,88.9 63.5,88.9 65.41,88.9 67.31,88.9 69.22,88.9 71.12,88.9 73.03,88.9 74.93,88.9 76.83,88.9 78.74,88.9 80.64,88.9 82.55,88.9 84.45,88.9 86.36,88.9 88.27,88.9 88.9,87.63 88.9,85.72 88.9,83.82 88.9,81.92 85.09,79.38 85.09,77.47 85.09,75.56 85.09,64.77 85.09,62.87 85.09,60.96 85.09,59.05 85.09,57.15 85.09,55.24 85.09,53.34 85.09,51.44 85.09,49.53 85.09,47.62 85.09,45.72 85.09,43.81 85.09,41.91 86.36,40.01 88.9,40.01 88.9,38.1 88.9,36.2 88.9,34.29 88.9,32.38 88.9,30.48 88.9,28.57 88.9,26.67 88.9,24.77 88.9,22.86 88.9,20.95 88.9,19.05 88.9,17.14 88.9,15.24 88.9,13.34 88.9,11.43 88.9,9.53 88.9,7.62 88.9,5.71 88.9,3.81 88.9,1.91 87,1.91 85.09,1.91 83.19,1.91 81.28,1.91 79.38,1.91 77.47,1.91 75.56,1.91 73.66,1.91 71.75,1.91 69.85,1.91 67.94,1.91 66.04,1.91 64.14,1.91 61.59,3.81 59.69,5.08 57.78,5.08 55.88,5.08 53.98,5.08 52.07,5.08 50.16,5.08 48.26,5.08 46.35,5.08 44.45,5.08 8.89,1.91 6.99,1.91 5.08,1.91 3.17,1.91 1.91,2.54 1.91,4.45 1.91,8.26 1.91,6.35 1.91,40.01 3.81,40.01 5.71,44.45 1.91,83.82 1.91,81.92 1.91,17.78 1.91,19.68 1.91,21.59 1.91,23.5 1.91,25.4 42.55,5.08 40.64,5.08 38.73,5.08 36.83,5.08 34.92,5.08 33.02,5.08 31.11,5.08 1.91,27.3 1.91,29.21 5.71,59.05 5.71,60.96 5.71,71.75 5.71,73.66 5.71,46.35 5.71,48.26 16.51,1.91 18.41,1.91 20.32,1.91 10.16,31.11 27.3,26.35 46.35,76.52 73.66,76.52 32.07,52.07 41.91,53.66 48.58,19.68 57.47,22.54 69.22,22.54 10.48,61.28 10.48,48.58 23.81,78.11 29.21,74.61 58.42,45.09 67.31,42.55 75.56,40.01 77.47,10.16 57.15,18.41 41.27,17.78 41.27,37.47 47.62,51.44 52.7,53.98 57.78,53.98 12.7,18.41 60.96,14.61 70.48,13.97 68.58,19.05 71.12,5.08 56.52,34.92 62.87,38.1 68.58,34.61 62.23,26.35 67.94,25.4 45.72,34.29 45.72,38.73 50.8,37.47 51.44,46.99 51.44,64.77 56.52,67.31 76.83,50.8 73.03,53.98 81.28,56.52 81.28,62.87 74.3,63.5 78.11,78.74 55.24,83.19 29.21,83.19 16.51,84.45 19.37,68.58 19.68,56.52 16.83,50.8 16.83,63.5 16.83,76.2 14.61,25.4 22.86,13.97 8.89,13.97 84.45,27.3 44.45,23.5 32.7,29.84 35.24,18.41
  pour GND: -3.81,93.98 97.16,93.98 97.16,92.71 97.16,-5.08 95.25,-5.08 -4.45,-5.08 -4.45,-2.54 -4.45,93.98
  pour Top: -5.08,3.81 -5.08,-3.17 85.72,-3.17 97.16,-3.17 97.16,92.71 -5.08,92.71
  pour Bottom: -7.62,-5.08 -6.99,88.27 -6.99,95.25 99.69,95.25 99.69,-5.08
MAG_CUR_SEN_X
  Bottom 0.203: R6.2 12.56,51.62 TP17.1 14.6,53.66 R24.2 28.26,53.66 28.89,53.02 U1.8
MAG_CUR_SEN_Y
  Bottom 0.203: R25.2 12.56,64.32 TP34.1 14.6,66.36 R47.2 28.26,66.36 28.89,65.72 U2.8
MAG_CUR_SEN_Z
  Bottom 0.203: R81.2 12.56,77.02 TP52.1 14.6,79.06 R89.2 28.26,79.06 28.89,78.42 U3.8
MAG_X_FIN
  Bottom 0.203: U1.7 27.62,50.16 28.26,49.53 29.84,49.53 TP8.1 34.12,45.26 34.12,17.78 39.66,12.24 JP1A.8
MAG_X_RIN
  Bottom 0.203: U1.6 26.35,49.85 27.67,48.53 28.94,48.53 TP9.1 33.76,43.71 33.76,14.05 JP1A.6
MAG_Y_FIN
  Bottom 0.203: U2.7 27.62,62.87 31.31,59.18 31.31,53.98 33.66,51.63 TP24.1 34.42,49.08 34.42,47.68 36.38,45.72 36.38,16.7 40.03,13.06 42.65,13.06 43.66,12.05 JP1A.12
MAG_Y_RIN
  Bottom 0.203: U2.6 26.35,63.4 30.96,58.79 30.96,50.64 TP25.1 36.03,45.57 36.03,16.55 41.66,10.93 JP1A.10
MAG_Z_FIN
  Bottom 0.203: U3.7 27.62,76.52 28.57,75.56 29.84,75.56 TP47.1 30.48,68.45 34.01,64.92 34.01,53.34 37.58,49.77 37.58,19.96 44.46,13.08 46.07,13.08 JP1B.4
MAG_Z_RIN
  Bottom 0.203: U3.6 26.35,76.1 29.48,72.97 29.48,67.04 TP48.1 32.38,66.04 33.66,64.77 33.66,53.19 37.22,49.62 37.22,19.81 46.87,10.16 JP1B.2
N$1  (via drill 0.35)
  Top 0.203: R3.2 v32.07,16.4 32.07,13.75 JP1A.4
N$2
  Bottom 0.203: U9.7 62.23,29.84 62.87,30.48 C69.1 63.97,32.52 R5.1
N$3
  Top 0.203: U7.9 36.55,68.86 36.39,69.02 34.19,69.02 C13.1
N$4
  Bottom 0.203: U14.7 50.48,29.84 51.12,30.48 C76.1 52.22,32.52 R29.1
N$6
  Bottom 0.203: U8.4 10.18,49.23 10.79,49.85 R12.1 11.56,49.03 11.43,48.9 R16.1
N$7
  Bottom 0.203: U20.7 73.98,29.84 74.61,30.48 C90.1 75.72,32.52 R50.1
N$8
  Bottom 0.203: U8.3 10.16,51.74 10.78,51.12 R6.1 11.56,51.94 11.43,52.07 R15.2
N$9
  Bottom 0.203: R17.1 R18.2 R15.1
N$10  (via drill 0.35)
  other vias: 69.22,53.66
N$16
  Bottom 0.203: R11.2 R22.2 R24.1
N$17
  Bottom 0.203: U12.4 10.18,61.93 10.79,62.55 R31.1 11.56,61.73 11.43,61.59 R33.1
N$19
  Top 0.203: U7.8 33.14,69.51 32.64,69.01 32.64,66.84 C14.2
N$20
  Bottom 0.203: U12.3 10.16,64.44 10.78,63.82 R25.1 11.56,64.64 11.43,64.77 R32.2
N$21
  Bottom 0.203: R34.1 R41.2 R32.1
N$22
  Bottom 0.203: R30.2 R42.2 R47.1
N$23
  Top 0.203: C13.2 36.51,68.26 36.56,68.21 U7.10
N$24
  Top 0.203: C35.1 46.1,68.86 U7.16
N$25  (via drill 0.35)
  Top 0.203: v60.33,19.68 v60.33,21.59
  Bottom 0.203: U9.13 v60.33,21.59 | v60.33,19.68 R23.2
N$26
  Bottom 0.203: U9.5 60.96,30.48 61.28,30.8 R14.1
N$27
  Top 0.203: C15.1 46.09,72.76 U7.22
N$28  (via drill 0.35)
  Top 0.203: U7.1 v39.37,74.06
  Bottom 0.203: R21.2 45.72,78.23 41.47,74.06 v39.37,74.06
N$29  (via drill 0.35)
  Top 0.203: U7.20 45.06,71.46 v45.09,71.44
  Bottom 0.203: R35.1 46.99,73.34 v45.09,71.44
N$30
  Top 0.203: C41.2 35.77,59.37 36.41,60.01 U10.4 U10.3 36.95,61.28 36.63,61.59 TP13.1 R72.2
N$31
  Top 0.203: R48.1 R49.2 45.29,59.37 44.65,60.01 U10.11
N$36
  Top 0.203: U6.9 19.65,35.84 19.8,36 19.8,38.2 C11.1
N$38
  Top 0.203: U6.8 20.3,39.25 19.79,39.75 17.63,39.75 C12.2
N$39
  Top 0.203: C11.2 19.05,35.88 19,35.83 U6.10
N$40
  Top 0.203: C28.1 19.65,26.29 U6.16
N$41
  Top 0.203: C19.1 23.55,26.3 U6.22
N$43  (via drill 0.35)
  Top 0.203: U6.1 v24.85,33.02
  Bottom 0.203: R67.2 29.02,26.67 24.85,30.92 v24.85,33.02
N$44  (via drill 0.35)
  Top 0.203: U6.20 22.25,27.33 v22.23,27.3
  Bottom 0.203: R68.1 24.13,25.4 v22.23,27.3
N$45  (via drill 0.35)
  Top 0.203: v51.12,20.64 49.53,20.64 v48.58,21.59
  Bottom 0.203: U14.13 v48.58,21.59 | R37.2 v51.12,20.64
N$46
  Bottom 0.203: R13.1 49.53,31.11 49.21,30.8 U14.5
N$48
  Bottom 0.203: U19.4 10.18,74.63 10.79,75.25 R83.1 11.56,74.43 11.43,74.3 R85.1
N$49
  Top 0.203: C32.2 10.16,36.62 10.79,35.98 U13.4 U13.3 12.06,35.45 12.38,35.76 TP28.1 R80.2
N$50
  Top 0.203: R78.1 R79.2 10.16,27.1 10.79,27.74 U13.11
N$51
  Top 0.203: C31.2 14.61,36.62 13.34,35.34 U13.2
N$52
  Top 0.203: C38.2 35.77,63.82 37.05,62.55 U10.2
N$53
  Bottom 0.203: U19.3 10.16,77.14 10.78,76.52 R81.1 11.56,77.33 11.43,77.47 R84.2
N$54
  Bottom 0.203: R86.1 R87.2 R84.1
N$55
  Bottom 0.203: R82.2 R88.2 R89.1
N$59  (via drill 0.35)
  Top 0.203: v72.07,19.68 v72.07,21.59
  Bottom 0.203: R51.2 v72.07,19.68 | U20.13 v72.07,21.59
N$60
  Bottom 0.203: U20.5 72.71,30.48 73.03,30.8 R4.1
N$63
  Top 0.203: U16.9 63.85,68.86 63.7,69.02 61.5,69.02 C54.1
N$64
  Top 0.203: U16.8 60.45,69.51 59.94,69.01 59.94,66.84 C55.2
N$65
  Top 0.203: C54.2 63.82,68.26 63.87,68.21 U16.10
N$66
  Top 0.203: C59.1 73.41,68.86 U16.16
N$68
  Top 0.203: C57.1 73.39,72.76 U16.22
N$69  (via drill 0.35)
  Top 0.203: U16.1 v66.67,74.06
  Bottom 0.203: R110.2 73.03,78.23 68.77,74.06 v66.67,74.06
N$70  (via drill 0.35)
  Top 0.203: U16.20 72.37,71.46 v72.39,71.44
  Bottom 0.203: R111.1 74.3,73.34 v72.39,71.44
N$71
  Top 0.203: C62.2 63.08,59.37 63.72,60.01 U17.4 U17.3 64.25,61.28 63.93,61.59 TP57.1 R119.2
N$72
  Top 0.203: R117.1 R118.2 72.59,59.37 71.96,60.01 U17.11
N$73
  Top 0.203: C61.2 63.08,63.82 64.35,62.55 U17.2
OUT1_X
  Bottom 0.203: R12.2 12.56,49.35 TP21.1 14.6,47.31 R11.1 R22.1 19.37,47.31 20,47.94 JP2.1
OUT1_Y
  Bottom 0.203: R31.2 12.56,62.05 TP39.1 14.6,60.01 R30.1 R42.1 19.69,60.01 20.32,60.64 JP3.1
OUT1_Z
  Bottom 0.203: R83.2 12.56,74.75 TP62.1 14.6,72.71 R82.1 R88.1 19.69,72.71 20.32,73.34 JP5.1
OUT2_X
  Bottom 0.203: JP2.2 TP22.1 22.86,52.7 23.8,51.77 U1.5
OUT2_Y
  Bottom 0.203: TP40.1 21.59,65.41 | JP3.2 21.27,65.09 21.59,65.41 | 21.59,65.41 22.86,65.41 23.8,64.47 U2.5
OUT2_Z
  Bottom 0.203: JP5.2 TP63.1 22.86,78.11 23.18,77.79 23.8,77.17 U3.5
RW_X_DIR
  Top 0.203: U7.23 45.09,73.41 45.34,73.66 49.21,73.66 49.96,72.92 53.6,72.92 55.25,71.27 55.25,19.32 47.4,11.47 46.21,11.47 45.68,10.94 45.68,7.71 46.18,7.2 48.03,7.2 JP1B.3
RW_X_I_SENS
  Top 0.203: U7.17 44.93,69.51 45.39,69.97 47.72,69.97 47.92,70.17 TP11.1 49.85,69.53 R7.2
  Bottom 0.203: U14.3 47.94,42.86 49.55,44.47 49.55,69.16 49.21,69.5 TP11.1
RW_X_LOCK
  Top 0.203: U7.18 45.08,70.16 45.24,70.33 47.57,70.33 48.37,71.12 48.91,71.12 49.55,71.75 R9.2 50.59,71.02 51.12,70.48 53.31,70.48 54.53,69.26 54.53,19.61 51.44,16.51 50.23,16.51 46.79,13.08 46.1,13.08 44.77,11.75 44.77,9.27 JP1A.11
RW_X_OUTFG  (via drill 0.35)
  Top 0.203: TP23.1 41.59,65.09 40.32,63.82 U10.1 | R8.2 v44.45,74.93 43.81,74.93 43.51,74.63 U7.24
  Bottom 0.203: v44.45,74.93 44.45,67.28 44.43,67.25 44.43,66.02 TP23.1
RW_X_SPD  (via drill 0.35)
  Top 0.203: U10.10 U10.5 36.83,58.74 35.24,57.15 R44.2 35.24,57.05 TP12.1 35.24,53.34 35.24,46.89 39.59,42.55 v50.48,42.55
  Bottom 0.203: v50.48,42.55 52.96,42.55 54.2,41.31 63.65,41.31 71.44,33.52 U20.3
RW_X_SPEED_CTRL
  Top 0.203: U7.19 44.82,70.81 47.55,70.81 48.22,71.48 48.77,71.48 49.85,72.56 53.46,72.56 54.89,71.12 54.89,19.46 51.18,15.75 49.97,15.75 46.94,12.72 46.24,12.72 45.12,11.6 45.12,7.66 44.45,6.99 42.83,6.99 JP1A.9
RW_Y_DIR
  Top 0.203: U16.23 72.39,73.41 72.64,73.66 76.83,73.66 77.47,73.03 81.15,73.03 82.01,72.16 82.01,65.73 78.82,62.53 78.82,55.45 71.05,47.69 71.05,38.03 66.82,33.8 66.82,17.42 62.87,13.47 62.87,8.26 60.96,6.35 52.8,6.35 JP1B.5
RW_Y_I_SENS
  Top 0.203: U16.17 72.23,69.51 72.69,69.97 75.03,69.97 75.22,70.17 TP55.1 77.15,69.53 R104.2
  Bottom 0.203: U14.4 48.58,42.86 49.91,44.19 49.91,61.34 53.66,65.09 69.72,65.09 70.49,64.33 71.12,64.33 71.56,64.77 75.56,64.77 76.86,66.06 76.86,66.94 76.83,66.96 76.83,68.61 76.86,68.64 76.86,69.16 76.52,69.5 TP55.1
RW_Y_LOCK
  Top 0.203: U16.18 72.38,70.16 72.55,70.33 74.88,70.33 75.67,71.12 76.22,71.12 76.86,71.75 R106.2 77.89,71.02 78.42,70.48 80.64,70.48 80.64,70.45 81.3,69.79 81.3,66.06 78.11,62.87 78.11,55.75 70.34,47.99 70.34,38.33 66.11,34.09 66.11,17.71 62.15,13.76 62.15,8.89 60.33,7.06 56.09,7.06 JP1B.9
RW_Y_OUTFG  (via drill 0.35)
  Top 0.203: TP61.1 68.9,65.09 67.63,63.82 U17.1 | R105.2 v71.75,74.93 71.12,74.93 70.82,74.63 U16.24
  Bottom 0.203: v71.75,74.93 71.75,67.28 71.73,67.25 71.73,66.02 TP61.1
RW_Y_SPD
  Top 0.203: U17.10 U17.5 64.14,58.74 62.55,57.15 | R116.2 62.55,57.15 | 62.55,57.15 TP56.1
  Bottom 0.203: TP56.1 62.55,42.92 72.07,33.39 U20.4
RW_Y_SPEED_CTRL
  Top 0.203: U16.19 72.12,70.81 72.13,70.81 74.86,70.81 75.53,71.48 76.07,71.48 77.23,72.63 81.04,72.63 81.66,72.01 81.66,65.88 78.46,62.68 78.46,55.6 70.7,47.84 70.7,38.18 66.46,33.95 66.46,17.57 62.51,13.61 62.51,8.53 60.68,6.71 54.44,6.71 JP1B.7
RW_Z_DIR
  Top 0.203: U6.23 24.2,27.3 24.45,27.05 24.45,21.94 31.13,15.26 31.13,12.05 32.7,10.48 32.7,7.35 33.02,7.03 33.02,6.99 34.48,6.99 JP1A.3
RW_Z_I_SENS  (via drill 0.35)
  Top 0.203: U6.17 20.3,27.46 20.76,27 20.76,24.67 20.95,24.47 TP26.1 20.32,22.54 R61.2 | v30.48,22.86 31.11,23.5 34.92,23.5 | 34.92,23.5 38.1,23.5 41.27,26.67 v41.27,29.84 | 34.92,23.5
  Bottom 0.203: U14.2 47.31,30.16 46.31,31.16 42.59,31.16 v41.27,29.84 | TP26.1 22.89,23.18 23.23,22.84 25.98,22.84 26,22.86 v30.48,22.86
RW_Z_LOCK
  Top 0.203: U6.18 20.95,28.58 20.95,28.57 20.95,27.31 21.11,27.15 21.11,24.82 21.91,24.02 21.91,23.48 22.54,22.84 R63.2 23.58,21.8 30.42,14.97 30.42,8.45 32.59,6.27 37.77,6.27 JP1A.7
RW_Z_OUTFG  (via drill 0.35)
  Top 0.203: TP38.1 15.88,30.8 14.61,32.07 U13.1 | R62.2 v25.72,27.94 25.72,28.57 25.41,28.88 U6.24
  Bottom 0.203: v25.72,27.94 18.07,27.94 18.04,27.96 16.8,27.96 TP38.1
RW_Z_SPD  (via drill 0.35)
  Top 0.203: U13.10 U13.5 9.53,35.56 7.94,37.15 R77.2 6.99,38.2 6.99,41.91 TP27.1 22.86,43.18 23.71,42.33 37.8,42.33 39,41.12 48.92,41.12 50.35,39.69 52.39,39.69 v53.66,40.96
  Bottom 0.203: U20.2 70.8,33.66 63.5,40.96 v53.66,40.96
RW_Z_SPEED_CTRL
  Top 0.203: U6.19 21.6,27.57 21.59,27.57 21.59,24.84 22.26,24.17 22.26,23.62 30.77,15.11 30.77,13.97 30.77,13.68 30.77,11.77 32.34,10.2 32.34,7.03 32.74,6.63 36.12,6.63 JP1A.5
UCB0_SPI_CLK
  Bottom 0.203: 58.42,23.18 58.42,23.97 59.97,25.52 66.29,25.52 68.64,23.18 70.16,23.18 U20.16 | 58.42,23.18 U9.16 | 58.42,23.18 56.56,23.18 54.21,25.52 48.22,25.52 46.67,23.97 U14.16 46.67,18.83 48.44,17.06 48.44,12.71 JP1B.6
UCB0_SPI_MISO
  Bottom 0.203: U20.12 72.71,21.27 72.04,20.6 70.2,20.6 69.25,21.55 68.81,21.55 68.23,22.13 68.23,22.58 66,24.8 61.8,24.8 60.96,23.97 U9.12 60.96,21.27 60.29,20.6 58.12,20.6 57.17,21.55 57.06,21.55 56.48,22.13 56.48,22.25 53.92,24.8 49.89,24.8 49.21,24.13 U14.12 49.21,17.8 49.51,17.5 49.51,16.85 50.76,15.6 53.49,15.6 54.99,14.09 JP1B.10
UCB0_SPI_MOSI
  Bottom 0.203: U20.14 71.44,21.33 71.06,20.96 70.35,20.96 69.4,21.91 68.95,21.91 68.58,22.28 68.58,22.73 66.15,25.16 60.88,25.16 59.69,23.97 U9.14 59.69,21.33 59.32,20.96 58.27,20.96 57.32,21.91 57.21,21.91 56.84,22.28 56.84,22.39 54.07,25.16 49.13,25.16 47.94,23.97 U14.14 47.95,18.57 49.15,17.36 49.15,16.7 50.62,15.24 53.34,15.24 53.98,14.61 53.98,11.14 JP1B.8
VINT/2_X
  Top 0.203: U7.3 37.07,72.76 36.73,72.42 36.73,71.8 37.07,71.46 U7.5 38.47,71.46 38.81,71.12 38.81,70.5 38.47,70.16 U7.7 36.52,70.16 36.2,70.48 C16.1 R1.1 R2.2
VINT/2_Y
  Top 0.203: U16.3 64.38,72.76 64.03,72.42 64.03,71.8 64.38,71.46 64.77,71.46 U16.5 65.77,71.46 66.11,71.12 66.11,70.5 65.77,70.16 U16.7 63.83,70.16 63.5,70.48 C58.1 R102.1 R103.2
VINT/2_Z
  Top 0.203: U6.3 23.55,35.32 23.21,35.66 22.59,35.66 22.25,35.32 U6.5 22.25,33.92 21.91,33.58 21.29,33.58 20.95,33.92 U6.7 20.95,35.87 21.27,36.2 C20.1 R59.1 R60.2
X_DNC_1  (via drill 0.35)
  Top 0.203: v40.01,56.52 40.01,57.15 39.69,57.47 U10.6
  Bottom 0.203: R36.1 v40.01,56.52
X_DNC_2  (via drill 0.35)
  Top 0.203: v38.73,54.61 38.22,55.13 U10.7
  Bottom 0.203: R39.1 v38.73,54.61
X_DNC_3  (via drill 0.35)
  Top 0.203: v41.27,62.87 42.23,63.82 U10.14
  Bottom 0.203: R43.1 41.27,59.69 40.64,60.33 40.64,62.23 v41.27,62.87
X_DNC_4  (via drill 0.35)
  Top 0.203: v41.27,61.5 42.32,62.55 U10.13
  Bottom 0.203: R40.1 42.55,54.61 41.91,55.24 41.91,59.91 41.27,60.55 v41.27,61.5
X_HALL_A
  Top 0.203: J4.3 39.55,78.11 39.14,77.7 39.14,76.92 TP5.1 37.47,76.2 36.55,75.29 36.55,73.66 36.8,73.41 U7.2
  Bottom 0.203: TP5.1 R19.1
X_HALL_B
  Top 0.203: J4.4 40.55,78.27 40.01,77.73 TP4.1 40.01,73.65 38.66,72.3 38.47,72.11 U7.4
  Bottom 0.203: TP4.1 R10.1
X_HALL_C
  Top 0.203: J4.2 38.55,77.6 38.1,77.15 TP2.1 36.35,76.68 36.2,76.52 36.2,71.44 36.83,70.81 U7.6
  Bottom 0.203: R20.1 TP2.1
X_PHASE_A
  Top 0.203: J4.11 J4.10 46.55,77.98 TP14.1 44.13,75.56 43.67,75.56 42.47,74.37 42.47,67.9 42.81,67.56 U7.14
X_PHASE_B
  Top 0.203: J4.9 J4.8 44.55,78.52 TP15.1 43.18,75.88 42.12,74.82 42.12,67.61 42.81,66.91 U7.13
X_PHASE_C
  Top 0.203: J4.7 J4.6 42.55,78.11 41.59,77.15 TP16.1 41.59,74.64 39.19,72.23 39.19,68.28 38.47,67.56 U7.11
Y_DNC_1  (via drill 0.35)
  Top 0.203: v67.31,56.52 67.31,57.15 66.99,57.47 U17.6
  Bottom 0.203: R112.1 v67.31,56.52
Y_DNC_2  (via drill 0.35)
  Top 0.203: v66.04,54.61 65.52,55.13 U17.7
  Bottom 0.203: R113.1 v66.04,54.61
Y_DNC_3  (via drill 0.35)
  Top 0.203: v68.58,62.87 69.53,63.82 U17.14
  Bottom 0.203: R115.1 68.58,59.69 67.94,60.33 67.94,62.23 v68.58,62.87
Y_DNC_4  (via drill 0.35)
  Top 0.203: v68.58,61.59 69.53,62.55 U17.13
  Bottom 0.203: R114.1 69.85,54.61 69.22,55.24 69.22,60.33 68.58,60.96 v68.58,61.59
Y_HALL_A
  Top 0.203: U16.2 64.11,73.41 63.86,73.66 63.86,75.29 64.77,76.2 TP53.1 66.44,76.92 66.44,77.7 66.85,78.11 J11.3
  Bottom 0.203: TP53.1 R108.1
Y_HALL_B
  Top 0.203: U16.4 65.11,72.07 65.72,72.07 65.95,72.3 65.96,72.3 67.31,73.65 TP50.1 67.31,77.73 67.85,78.27 J11.4
  Bottom 0.203: TP50.1 R107.1
Y_HALL_C
  Top 0.203: U16.6 64.14,70.81 63.5,71.44 63.5,76.52 TP49.1 65.09,77.15 65.85,77.92 J11.2
  Bottom 0.203: R109.1 TP49.1
Y_PHASE_A
  Top 0.203: J11.11 J11.10 73.85,77.98 TP58.1 71.44,75.56 70.97,75.56 69.78,74.37 69.78,67.9 70.12,67.56 U16.14
Y_PHASE_B
  Top 0.203: J11.9 J11.8 71.85,78.52 TP59.1 70.48,75.88 69.42,74.82 69.42,67.61 70.12,66.91 U16.13
Y_PHASE_C
  Top 0.203: J11.7 J11.6 69.85,78.11 68.9,77.15 TP60.1 68.9,74.64 66.49,72.23 66.49,68.28 65.77,67.56 U16.11
Z_DNC_1  (via drill 0.35)
  Top 0.203: v5.71,33.02 6.52,33.02 6.65,32.89 7.49,32.89 8.26,33.66 U13.6
  Bottom 0.203: R69.1 v5.71,33.02
Z_DNC_2  (via drill 0.35)
  Top 0.203: v5.71,34.29 6.87,34.29 U13.7
  Bottom 0.203: R70.1 v5.71,34.29
Z_DNC_3  (via drill 0.35)
  Top 0.203: v13.97,31.11 14.61,30.48 U13.14
  Bottom 0.203: R75.1 13.34,31.75 v13.97,31.11
Z_DNC_4  (via drill 0.35)
  Top 0.203: v12.7,31.11 13.34,30.48 U13.13
  Bottom 0.203: R71.1 10.79,30.48 11.43,31.11 v12.7,31.11
Z_HALL_A
  Top 0.203: U6.2 24.2,35.59 24.45,35.84 26.07,35.84 26.99,34.92 TP20.1 27.71,33.25 28.49,33.25 28.89,32.84 J2.3
  Bottom 0.203: TP20.1 R65.1
Z_HALL_B
  Top 0.203: U6.4 22.86,34.58 22.86,33.97 23.09,33.74 23.09,33.73 24.44,32.38 TP19.1 28.52,32.38 29.05,31.84 J2.4
  Bottom 0.203: TP19.1 R64.1
Z_HALL_C
  Top 0.203: U6.6 21.6,35.56 22.23,36.2 27.3,36.2 TP18.1 27.94,34.29 28.39,33.84 J2.2
  Bottom 0.203: R66.1 TP18.1
Z_PHASE_A
  Top 0.203: J2.11 J2.10 28.77,25.84 TP29.1 26.35,28.26 26.35,28.72 25.16,29.92 18.69,29.92 18.35,29.58 U6.14
Z_PHASE_B
  Top 0.203: J2.9 J2.8 29.3,27.84 TP33.1 26.67,29.21 25.61,30.27 18.39,30.27 17.7,29.58 U6.13
Z_PHASE_C
  Top 0.203: J2.7 J2.6 28.89,29.84 27.94,30.8 TP37.1 25.42,30.8 23.02,33.2 19.07,33.2 18.35,33.92 U6.11

## Text on the board
tPlace: ACTUATOR BOARD - REV B | LORIS CubeSat ADCS Subsystem | Designers: | T.Christison,J.Smith,C.Mattatall | +5V | 3V3 | GND
tNames: +5V | GND | Z | GND | +5V | Y | X | +5V | GND